# Altium schematic sheet MCU.SchDoc
size A4; SheetNumber: 2; SheetTotal: 4
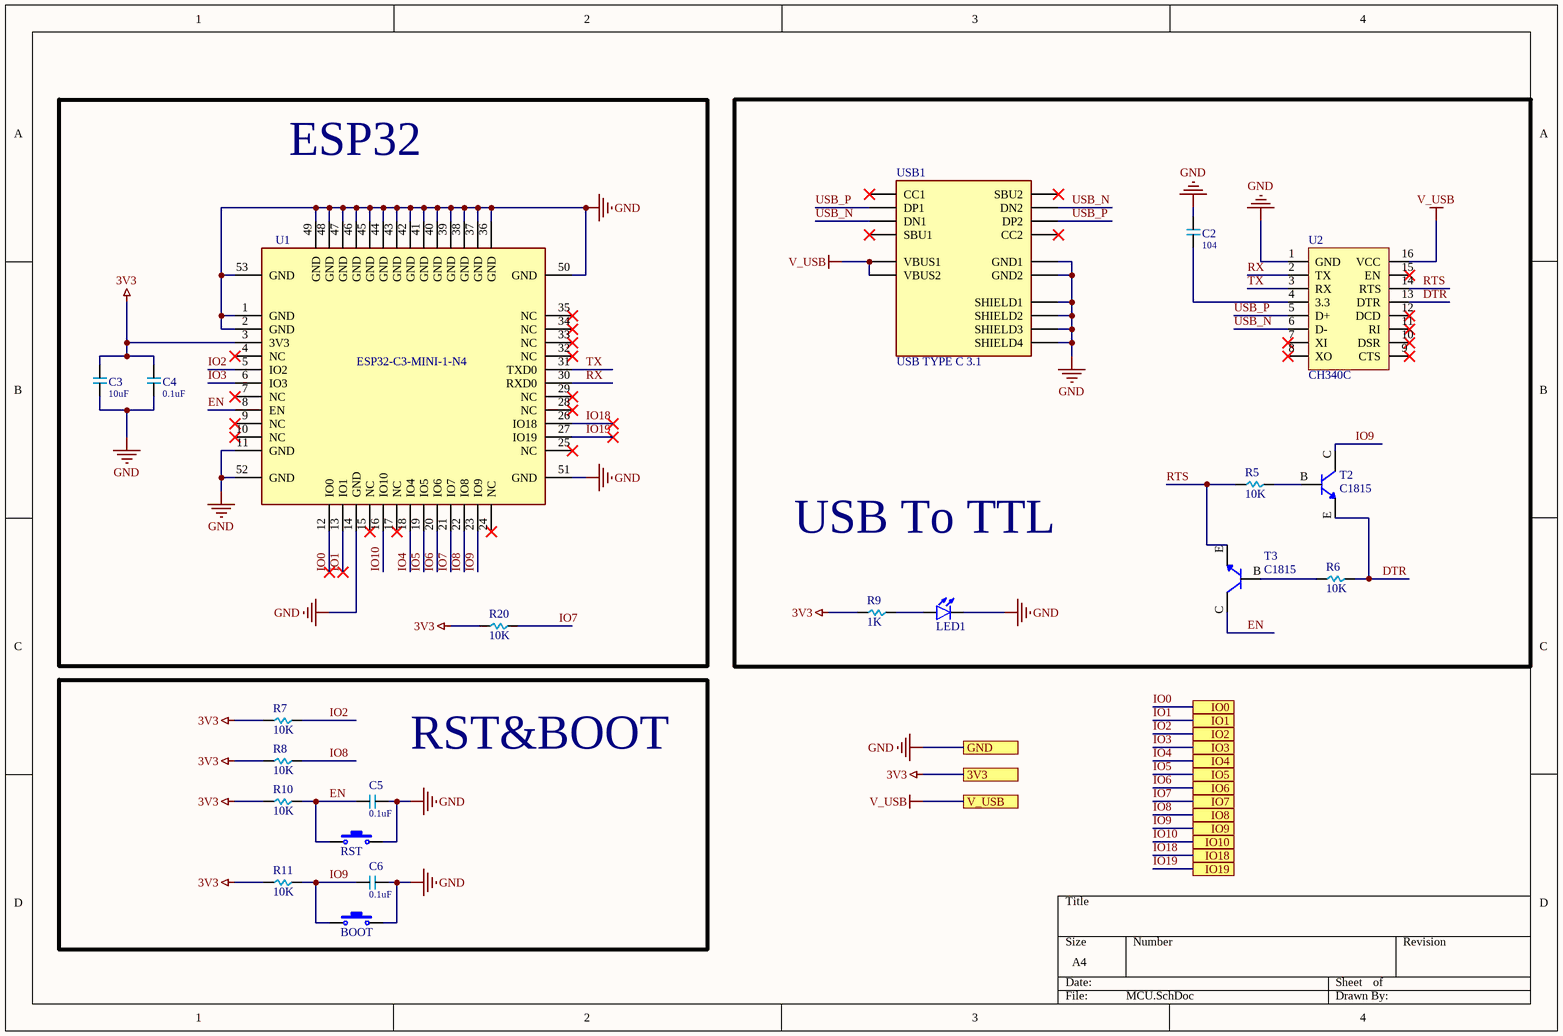
[diagram p0: MCU.SchDoc]

## Parts
BOOT  BUTTON  [BUTTON 3x4x2]  (value not drawn)
C2  104  [CAP 0603]
C3  10uF  [CAP 0603]
C4  0.1uF  [CAP 0603]
C5  0.1uF  [CAP 0603]
C6  0.1uF  [CAP 0603]
LED1  Green  [LED 0603]  (value not drawn)
R5  10K  [RES 0603]
R6  10K  [RES 0603]
R7  10K  [RES 0603]
R8  10K  [RES 0603]
R9  1K  [RES 0603]
R10  10K  [RES 0603]
R11  10K  [RES 0603]
R20  10K  [RES 0603]
RST  BUTTON  [BUTTON 3x4x2]  (value not drawn)
T2  C1815  [C1815]
T3  C1815  [C1815]
U1  ESP32-C3-MINI-1-N4  [ESP32-C3-MINI-1-N4]
U2  CH340C  [SOP16]
USB1  USB TYPE C 3.1  [USB TYPE C 3.1]

## Blocks framed on the sheet
ESP32: C3 C4 R20 U1
USB To TTL: C2 LED1 R5 R6 R9 T2 T3 U2 USB1
RST&BOOT: BOOT C5 C6 R7 R8 R10 R11 RST

## Ports
3V3, GND, IO0, IO1, IO2, IO3, IO4, IO5, IO6, IO7, IO8, IO9, IO10, IO18, IO19, V_USB

## Nets
3V3: C3.2 C4.2 R7.2 R8.2 R9.2 R10.2 R11.2 R20.2 U1.3(3V3) ; port 3V3
GND: BOOT.2 C2.2 C3.1 C4.1 C5.2 C6.2 LED1.K RST.2 U1.1(GND) U1.2(GND) U1.11(GND) U1.14(GND) U1.36(GND) U1.37(GND) U1.38(GND) U1.39(GND) U1.40(GND) U1.41(GND) U1.42(GND) U1.43(GND) U1.44(GND) U1.45(GND) U1.46(GND) U1.47(GND) U1.48(GND) U1.49(GND) U1.50(GND) U1.51(GND) U1.52(GND) U1.53(GND) U2.1(GND) USB1.A1B12(GND1) USB1.B1A12(GND2) USB1.SH1(SHIELD1) USB1.SH2(SHIELD2) USB1.SH3(SHIELD3) USB1.SH4(SHIELD4) ; port GND
V_USB: U2.16(VCC) USB1.A4B9(VBUS1) USB1.B4A9(VBUS2) ; port V_USB
DTR: R6.1 T2.E U2.13(DTR)
EN: C5.1 R10.1 RST.1 T3.C U1.8(EN)
IO0: U1.12(IO0) ; port IO0
IO1: U1.13(IO1) ; port IO1
IO2: R7.1 U1.5(IO2) ; port IO2
IO3: U1.6(IO3) ; port IO3
IO4: U1.18(IO4) ; port IO4
IO5: U1.19(IO5) ; port IO5
IO6: U1.20(IO6) ; port IO6
IO7: R20.1 U1.21(IO7) ; port IO7
IO8: R8.1 U1.22(IO8) ; port IO8
IO9: BOOT.1 C6.1 R11.1 T2.C U1.23(IO9) ; port IO9
IO10: U1.16(IO10) ; port IO10
IO18: U1.26(IO18) ; port IO18
IO19: U1.27(IO19) ; port IO19
RTS: R5.2 T3.E U2.14(RTS)
RX: U1.30(RXD0) U2.2(TX)
TX: U1.31(TXD0) U2.3(RX)
USB_N: U2.6(D-) USB1.A7(DN1) USB1.B7(DN2)
USB_P: U2.5(D+) USB1.A6(DP1) USB1.B6(DP2)
NetC2_1: C2.1 U2.4(3.3)
NetLED1_A: LED1.A R9.1
NetR5_1: R5.1 T2.B
NetR6_2: R6.2 T3.B

Not connected (* = marked no-connect by the designer): U1 4(NC)* 7(NC)* 9(NC)* 10(NC)* 15(NC)* 17(NC)* 24(NC)* 25(NC)* 28(NC)* 29(NC)* 32(NC)* 33(NC)* 34(NC)* 35(NC)*; U2 7(XI)* 8(XO)* 9(CTS)* 10(DSR)* 11(RI)* 12(DCD)* 15(EN)*; USB1 A5(CC1)* A8(SBU1)* B5(CC2)* B8(SBU2)*

## Library data of the parts
C2-C6 = CAP
  C2: Value: 104
  C3: Value: 10uF
  C4-C6: Value: 0.1uF
LED1 = LED SM: Value: Green
R5-R11 R20 = RES
  R5-R8 R10 R11 R20: Value: 10K
  R9: Value: 1K
U1 = ESP32-C3-MINI-1-N4: MF: {'manufacturer': u'Espressif Systems'}; Package: None; Price: None; Value: *; MP: ESP32-C3-MINI-1-N4; Availability: Unavailable
U2 = CH340G
USB1 = USB TYPE C 3.1: 16P